# Altium schematic sheet TLE5012.SchDoc
size A4
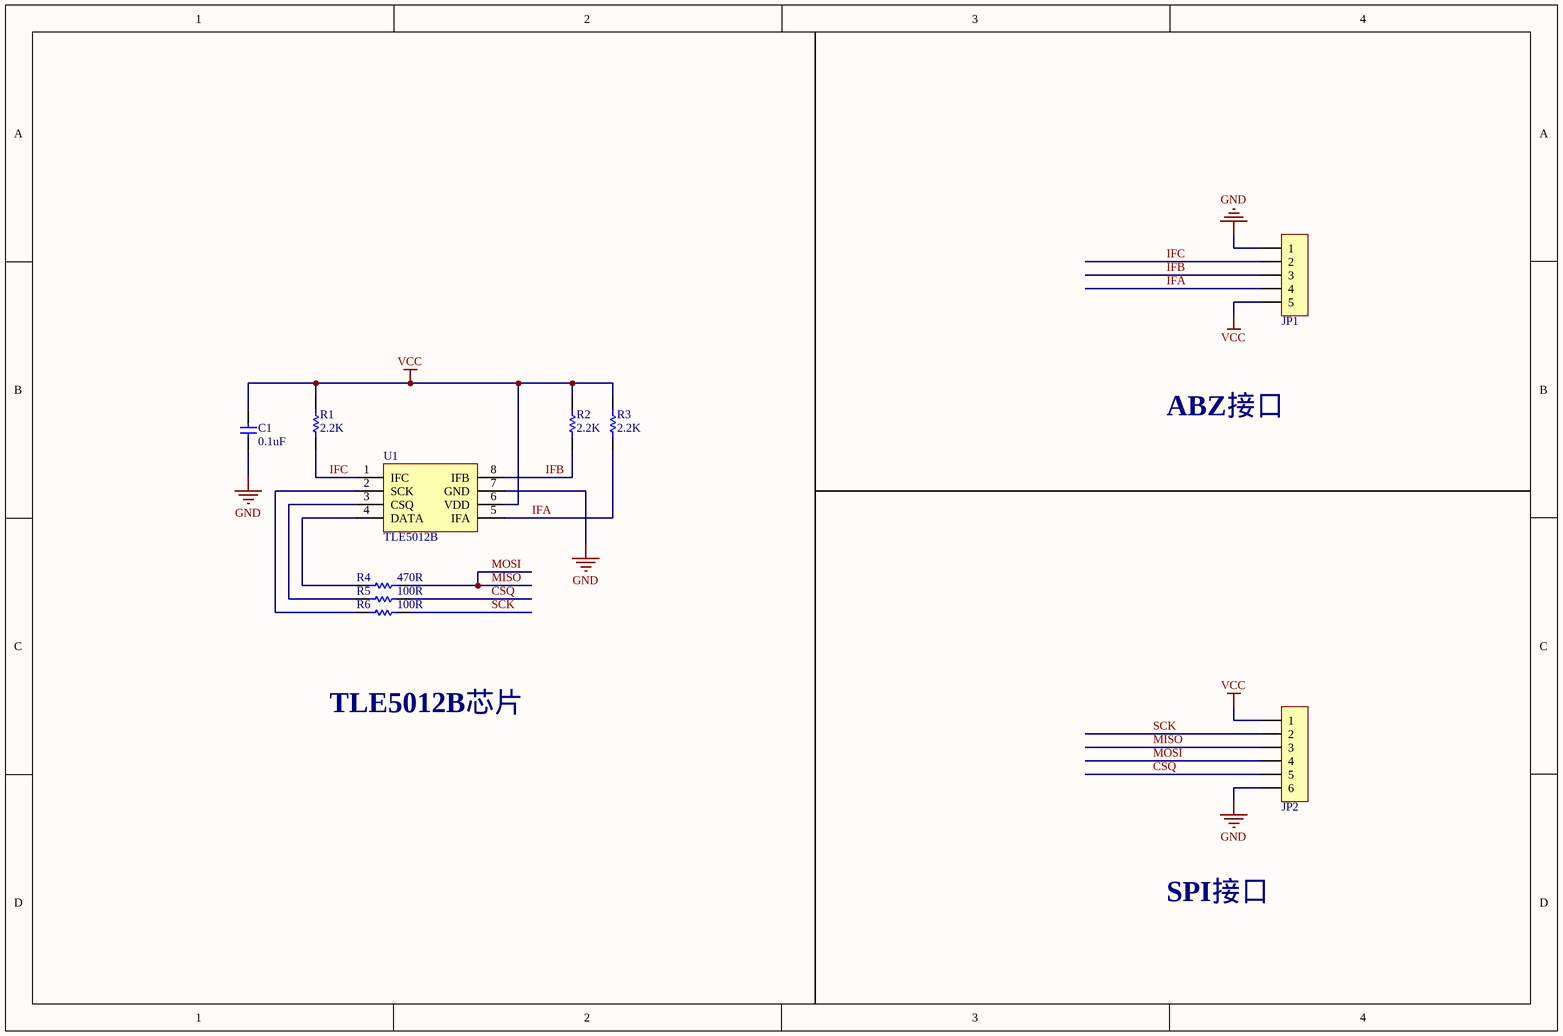
[diagram p0: TLE5012.SchDoc]

## Parts
C1  0.1uF  [0603C]
JP1  SH1.0P5  [CONN-SMD_M1010RS-05P]  (value not drawn)
JP2  HDR-1X6  [GH1.25-WS-6P]  (value not drawn)
R1  2.2K  [0603RH]
R2  2.2K  [0603RH]
R3  2.2K  [0603RH]
R4  470R  [0603RH]
R5  100R  [0603RH]
R6  100R  [0603RH]
U1  TLE5012B  [TLE5012B]

## Nets
GND: C1.1 JP1.1 JP2.6 U1.7(GND)
VCC: C1.2 JP1.5 JP2.1 R1.2 R2.2 R3.2 U1.6(VDD)
CSQ: JP2.5 R5.2
IFA: JP1.4 R3.1 U1.5(IFA)
IFB: JP1.3 R2.1 U1.8(IFB)
IFC: JP1.2 R1.1 U1.1(IFC)
MISO: JP2.3 JP2.4 R4.2  [also labelled MOSI]
SCK: JP2.2 R6.2
NetR4_1: R4.1 U1.4(DATA)
NetR5_1: R5.1 U1.3(CSQ)
NetR6_1: R6.1 U1.2(SCK)

## Notes on the sheet
- ABZ接口
- TLE5012B芯片
- SPI接口

## Library data of the parts
C1 = CAP: 无极性电容
JP1 = SH1.0P5: BOM名称: 5P接插件
JP2 = Header 6: 6P接插件; BOM名称: 6P接插件
R1-R6 = RES